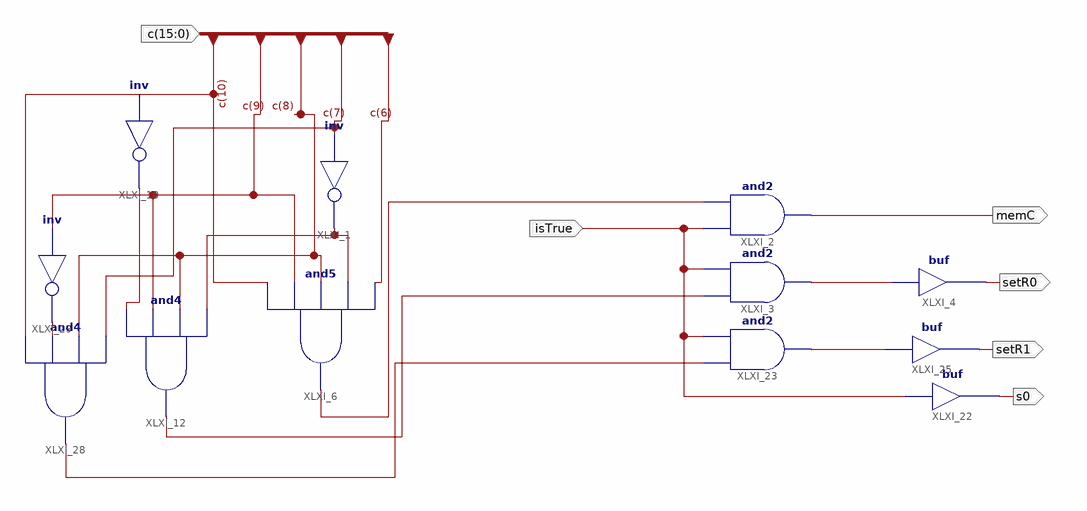
[diagram p0: schematic sheet 1]
// Xilinx ISE schematic STA.sch (spartan3e) as structural Verilog: 12 symbols, 6 ports
module STA (
  input  isTrue,
  input  [15:0] c,
  output memC,
  output setR0,
  output s0,
  output setR1
);

  wire XLXN_23, XLXN_24, XLXN_27, XLXN_35, XLXN_37, XLXN_61, XLXN_62, XLXN_66;

  not XLXI_1 (XLXN_23, c[7]);
  and XLXI_2 (memC, isTrue, XLXN_24);
  and XLXI_3 (XLXN_27, XLXN_37, isTrue);
  buf XLXI_4 (setR0, XLXN_27);
  not XLXI_10 (XLXN_35, c[10]);
  and XLXI_6 (XLXN_24, c[10], c[9], c[8], XLXN_23, c[6]);
  and XLXI_12 (XLXN_37, XLXN_35, c[9], c[8], XLXN_23);
  and XLXI_23 (XLXN_61, XLXN_66, isTrue);
  buf XLXI_22 (s0, isTrue);
  buf XLXI_25 (setR1, XLXN_61);
  and XLXI_28 (XLXN_66, c[10], XLXN_62, c[8], c[7]);
  not XLXI_29 (XLXN_62, c[9]);
endmodule
